# Altium schematic sheet extension board.schdoc
size 222 x 162 mm
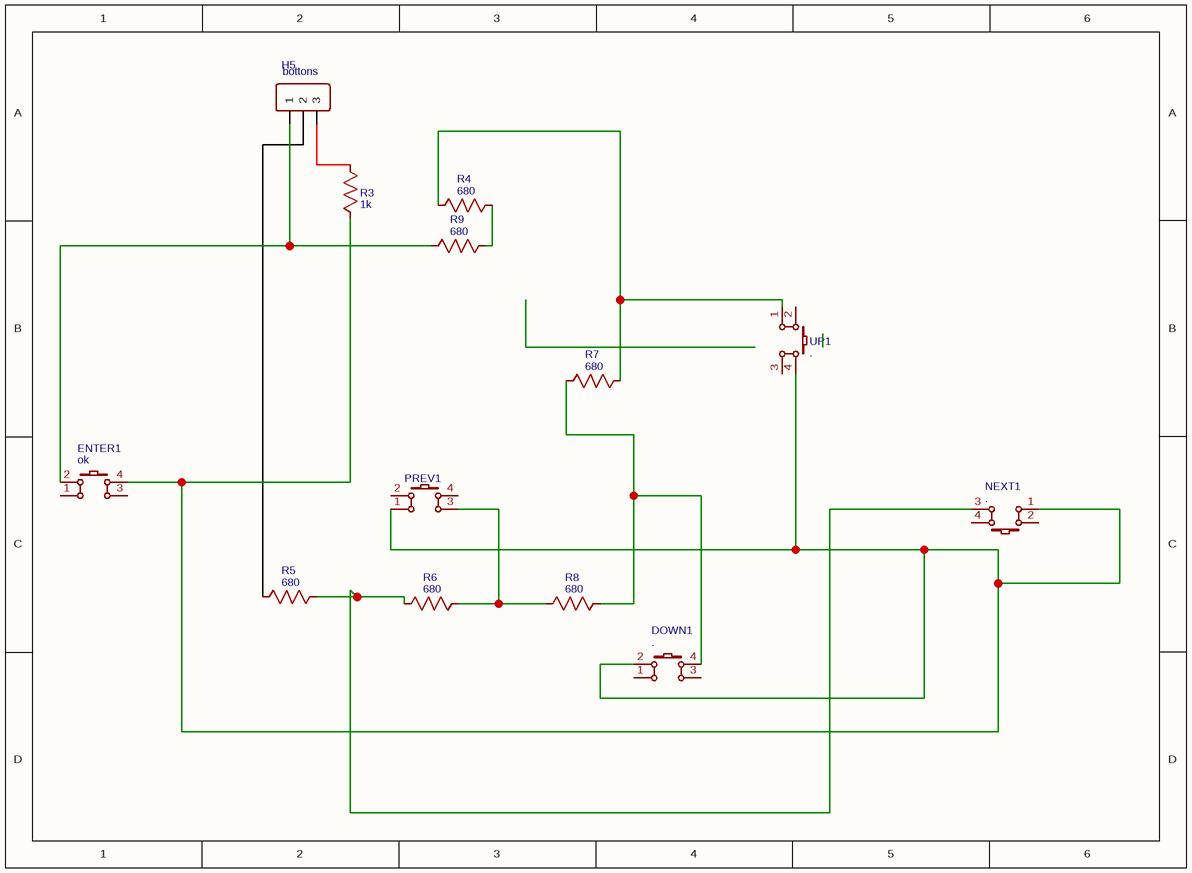
[diagram p0: extension board.schdoc]

## Parts
DOWN1  .  [KEY-TH_4P-L6.0-W6.0-P4.50-LS6.5]
ENTER1  ok  [KEY-TH_4P-L6.0-W6.0-P4.50-LS6.5]
H5  bottons  [HDR-F-2.54_1X3]
NEXT1  .  [KEY-TH_4P-L6.0-W6.0-P4.50-LS6.5]
PREV1  .  [KEY-TH_4P-L6.0-W6.0-P4.50-LS6.5]
R3  1k  [R_AXIAL-0.3]
R4  680  [R_AXIAL-0.3]
R5  680  [R_AXIAL-0.3]
R6  680  [R_AXIAL-0.3]
R7  680  [R_AXIAL-0.3]
R8  680  [R_AXIAL-0.3]
R9  680  [R_AXIAL-0.3]
UP1  .  [KEY-TH_4P-L6.0-W6.0-P4.50-LS6.5]

## Nets
NetDOWN1_2: DOWN1.2 ENTER1.4 NEXT1.1 PREV1.1 R3.1 UP1.4
NetDOWN1_4: DOWN1.4 R7.1 R8.2
NetENTER1_2: ENTER1.2 H5.1 R9.1
NetH5_2: H5.2 R5.1
NetH5_3: H5.3 R3.2
NetNEXT1_3: NEXT1.3 R5.2 R6.1
NetPREV1_3: PREV1.3 R6.2 R8.1
NetR4_1: R4.1 R7.2 UP1.1
NetR4_2: R4.2 R9.2

Not connected (* = marked no-connect by the designer): DOWN1 1 3; ENTER1 1 3; NEXT1 2 4; PREV1 2 4; UP1 2 3

## Library data of the parts
DOWN1 NEXT1 PREV1 UP1 = .: BOM_Manufacturer: 韩国韩荣; BOM_Manufacturer Part: K2-1102DP-E4SW-04; Contributor: LCEDA_Lib; BOM_Supplier: LCSC; BOM_Supplier Part: C136684; spicePre: K; spiceSymbolName: K4-6×6_TH
ENTER1 = ok: BOM_Manufacturer: 韩国韩荣; BOM_Manufacturer Part: K2-1102DP-E4SW-04; Contributor: LCEDA_Lib; BOM_Supplier: LCSC; BOM_Supplier Part: C136684; spicePre: K; spiceSymbolName: K4-6×6_TH
H5 = bottons: Contributor: LCEDA_Lib; BOM_Supplier Part: C146690; BOM_Supplier: LCSC; spicePre: H; spiceSymbolName: HDR-F-2.54_1x3
R3 = 1k: nameAlias: Value(Ω); Contributor: LCEDA_Lib; spicePre: R; spiceSymbolName: R_AXIAL-0.3_US
R4-R9 = 680: nameAlias: Value(Ω); Contributor: LCEDA_Lib; spicePre: R; spiceSymbolName: R_AXIAL-0.3_US